# Altium schematic sheet Main Board.SchDoc (part 2 of 2)
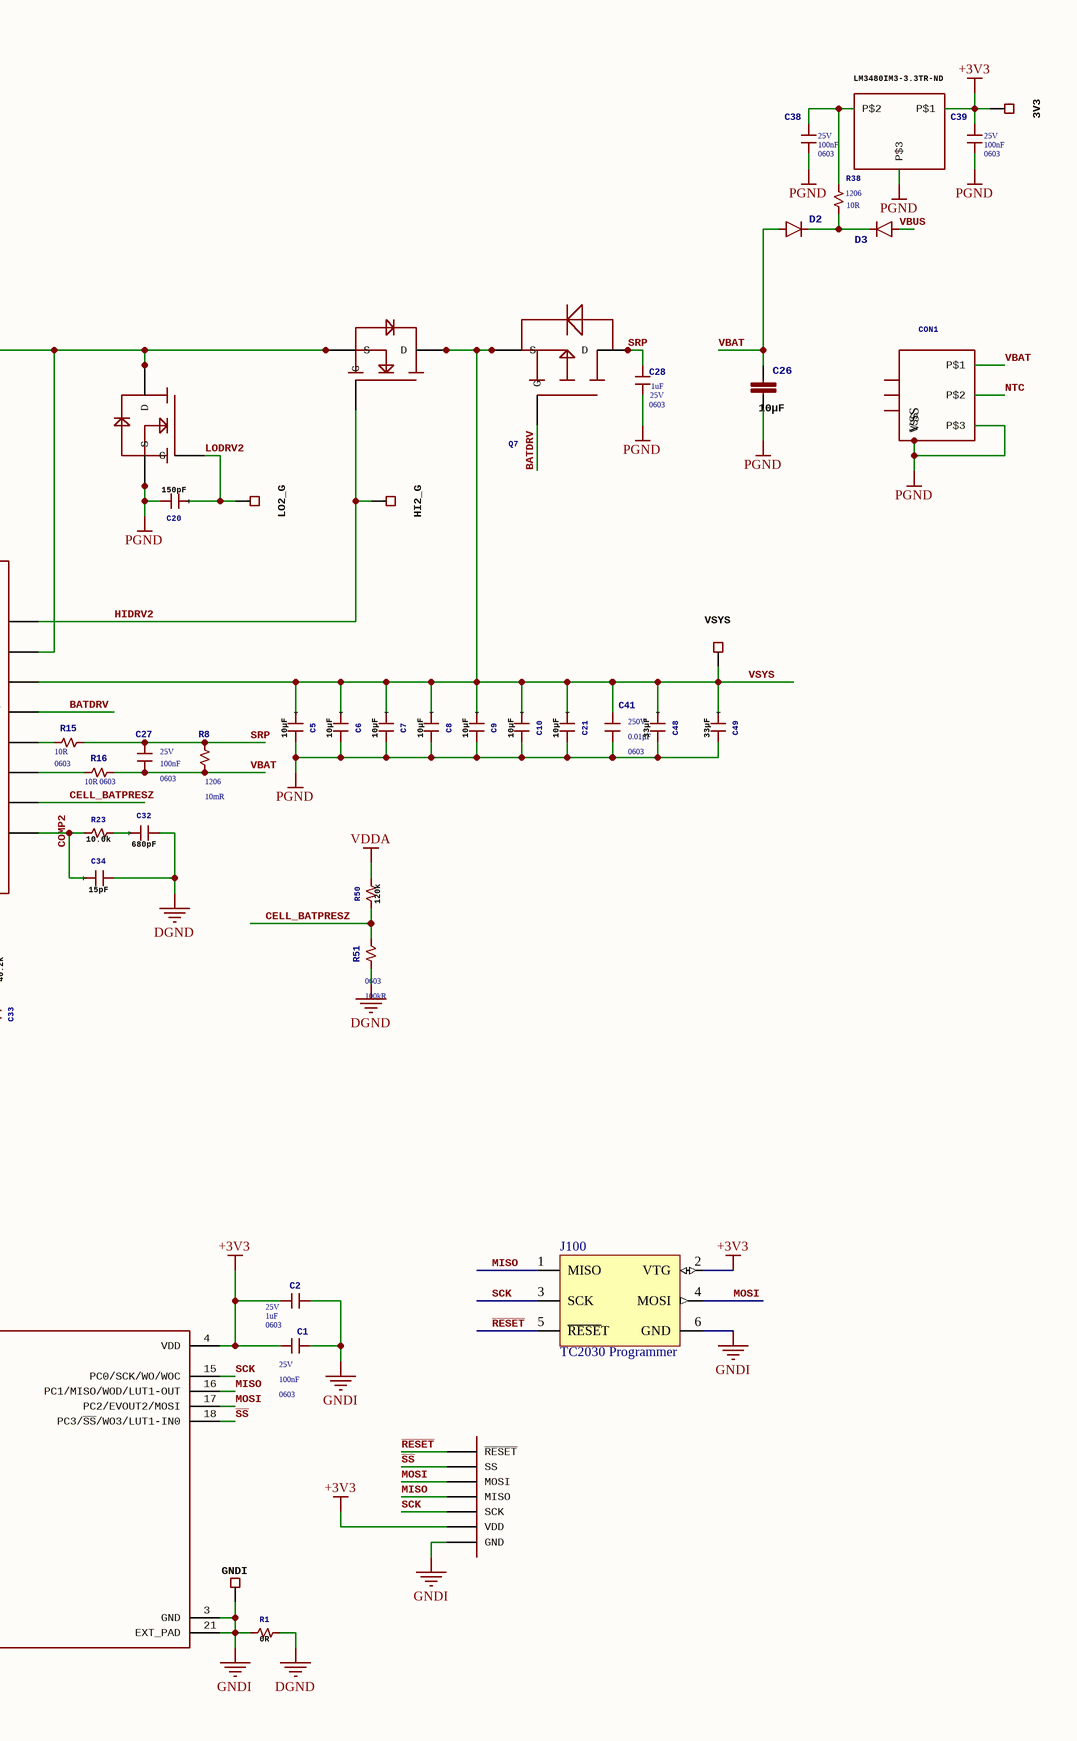
[diagram p2: Main Board.SchDoc, right]

## Library data of the parts
C1 C22 C27 C38 C39 = CGA3E2X7R1E104K080AA: 0.1µF ±10% 25V Ceramic Capacitor X7R 0603 (1608 Metric); Manufacturer: TDK; Supplier 1: Digi-Key; Manufacturer Part Number: CGA3E2X7R1E104K080AA; Stock 1: 2114238; Pricing 1: 1 = 0.10000, 10 = 0.05700, 100 = 0.02530, 500 = 0.01810, 1000 = 0.01422 (USD); RoHS: Yes; Mount: Surface Mount; Weight: 7.1E-05oz; Case Code (Metric): 1608; Case Code (Imperial): 0603; Min Operating Temperature: -55°C; Max Operating Temperature: 125°C; Packaging: Tape and Reel; Tolerance: 10%; Dielectric: X7R; Termination: SMD/SMT; Package Quantity: 1; Voltage Rating (DC): 25V; Composition: Ceramic; Length: 1.6mm; Height: 0.8mm; Depth: 0.8mm; Width: 0.031inch; Thickness: 0.035inch; Ratings: AEC-Q200; Lead Free: Lead Free; REACH SVHC: No SVHC; ComponentLink1URL: https://datasheet.ciiva.com/24220/cga3e2x7r1e104k080aa-265934-24220022.pdf?src-supplier=Mouser; ComponentLink1Description: https://datasheet.ciiva.com/24220/cga3e2x7r1e104k080aa-265934-24220022.pdf?src-supplier=Mouser; ComponentLink2URL: https://datasheet.ciiva.com/22725/1735392-22725638.pdf?src-supplier=Element14; ComponentLink2Description: https://datasheet.ciiva.com/22725/1735392-22725638.pdf?src-supplier=Element14; ComponentLink3URL: https://datasheet.ciiva.com/22725/1735392-22725639.pdf?src-supplier=Element14; ComponentLink3Description: https://datasheet.ciiva.com/22725/1735392-22725639.pdf?src-supplier=Element14; ComponentLink4URL: https://datasheet.ciiva.com/16427/mlccspec-automotive-general-midvoltage-en-16427320.pdf?src-supplier=Future+Electronics; ComponentLink4Description: https://datasheet.ciiva.com/16427/mlccspec-automotive-general-midvoltage-en-16427320.pdf?src-supplier=Future+Electronics; ComponentLink5URL: https://datasheet.ciiva.com/23803/1735392-23803082.pdf?src-supplier=Newark; ComponentLink5Description: https://datasheet.ciiva.com/23803/1735392-23803082.pdf?src-supplier=Newark; Supplier Part Number 1: 445-5667-1-ND; Case/Package: 0603
C2 C18 C28 C29 = CL10B105KA8NNNC: 1µF ±10% 25V Ceramic Capacitor X7R 0603 (1608 Metric); Manufacturer: Samsung; Supplier 1: Digi-Key; Manufacturer Part Number: CL10B105KA8NNNC; Stock 1: 3906966; Pricing 1: 1 = 0.10000, 10 = 0.06000, 100 = 0.02670, 500 = 0.01904, 1000 = 0.01496 (USD); RoHS: Yes; Mount: Surface Mount; Case Code (Metric): 1608; Case Code (Imperial): 0603; Contact Plating: Tin; Min Operating Temperature: -55°C; Max Operating Temperature: 125°C; Tolerance: 10%; Dielectric: X7R; Packaging: Tape and Reel; Voltage Rating: 25V; Package Quantity: 1; Length: 1.6mm; Height: 0.8mm; Width: 0.031inch; Thickness: 0.035inch; Depth: 0.8mm; Radiation Hardening: No; ComponentLink1URL: https://datasheet.ciiva.com/16449/cl10b105ka8nnnc-16449544.pdf?src-supplier=Future+Electronics; ComponentLink1Description: https://datasheet.ciiva.com/16449/cl10b105ka8nnnc-16449544.pdf?src-supplier=Future+Electronics; ComponentLink2URL: https://datasheet.ciiva.com/15195/getdatasheetpartid-359554-15195726.pdf?src-supplier=Verical; ComponentLink2Description: https://datasheet.ciiva.com/15195/getdatasheetpartid-359554-15195726.pdf?src-supplier=Verical; Supplier Part Number 1: 1276-1184-1-ND; Case/Package: 0603
C3 C4 C23 C24 C44 C45 = GRM21BR61E106KA73L: 10µF ±10% 25V Ceramic Capacitor X5R 0805 (2012 Metric); Manufacturer: Murata; Supplier 1: Digi-Key; Manufacturer Part Number: GRM21BR61E106KA73L; Stock 1: 16089237; Pricing 1: 1 = 0.43000, 10 = 0.29600, 100 = 0.17730, 500 = 0.13300, 1000 = 0.11231 (USD); RoHS: Yes; Mount: Surface Mount; Case Code (Metric): 2012; Case Code (Imperial): 0805; Material: Ceramic; Min Operating Temperature: -55°C; Max Operating Temperature: 85°C; Tolerance: 10%; Dielectric: X5R; Package Quantity: 1; Packaging: Tape and Reel; Voltage Rating (DC): 25V; Termination: SMD/SMT; Voltage: 25V; Length: 2mm; Height: 1.25mm; Width: 0.049inch; Thickness: 0.053inch; Depth: 1.25mm; Radiation Hardening: No; REACH SVHC: Unknown; Lead Free: Lead Free; ComponentLink1URL: https://datasheet.ciiva.com/5424/product-5424327.pdf?src-supplier=Mouser; ComponentLink1Description: https://datasheet.ciiva.com/5424/product-5424327.pdf?src-supplier=Mouser; ComponentLink2URL: https://datasheet.ciiva.com/22774/1747469-22774396.pdf?src-supplier=Farnell; ComponentLink2Description: https://datasheet.ciiva.com/22774/1747469-22774396.pdf?src-supplier=Farnell; ComponentLink3URL: https://datasheet.ciiva.com/28584/626718-28584288.pdf?src-supplier=Element14; ComponentLink3Description: https://datasheet.ciiva.com/28584/626718-28584288.pdf?src-supplier=Element14; ComponentLink4URL: https://datasheet.ciiva.com/16440/grm21br61e106ka73l-16440627.pdf?src-supplier=Future+Electronics; ComponentLink4Description: https://datasheet.ciiva.com/16440/grm21br61e106ka73l-16440627.pdf?src-supplier=Future+Electronics; ComponentLink5URL: https://datasheet.ciiva.com/29199/454623-da-01-en-vs-kondensator-0805-29199615.pdf?src-supplier=Conrad; ComponentLink5Description: https://datasheet.ciiva.com/29199/454623-da-01-en-vs-kondensator-0805-29199615.pdf?src-supplier=Conrad; ComponentLink6URL: https://datasheet.ciiva.com/139/partnumbering-e-01-139184.pdf?src-supplier=Digi-Key; ComponentLink6Description: https://datasheet.ciiva.com/139/partnumbering-e-01-139184.pdf?src-supplier=Digi-Key; ComponentLink7URL: https://datasheet.ciiva.com/28584/626718-28584279.pdf?src-supplier=Element14; ComponentLink7Description: https://datasheet.ciiva.com/28584/626718-28584279.pdf?src-supplier=Element14; ComponentLink8URL: https://datasheet.ciiva.com/14116/grmseries-highdielectrictype-eng-14116376.pdf?src-supplier=Distrelec; ComponentLink8Description: https://datasheet.ciiva.com/14116/grmseries-highdielectrictype-eng-14116376.pdf?src-supplier=Distrelec; ComponentLink9URL: https://datasheet.ciiva.com/139/partnumbering-e-01-139182.pdf?src-supplier=Digi-Key; ComponentLink9Description: https://datasheet.ciiva.com/139/partnumbering-e-01-139182.pdf?src-supplier=Digi-Key; ComponentLink10URL: https://datasheet.ciiva.com/139/partnumbering-e-01-139183.pdf?src-supplier=Digi-Key; ComponentLink10Description: https://datasheet.ciiva.com/139/partnumbering-e-01-139183.pdf?src-supplier=Digi-Key; ComponentLink11URL: https://datasheet.ciiva.com/7719/1747469-7719093.pdf?src-supplier=Element14; ComponentLink11Description: https://datasheet.ciiva.com/7719/1747469-7719093.pdf?src-supplier=Element14; Supplier Part Number 1: 490-5523-1-ND; Case/Package: 0805
C5-C10 C21 C25 = SMD_CAP0805: GateName_1: G$1; SymbolName_1: CAPACITOR; DeviceName: 0805; LibraryName: Roambotics; DeviceSetName: SMD_CAP; +: +
C11 C31-C34 = SMD_CAP0402: GateName_1: G$1; SymbolName_1: CAPACITOR; DeviceName: 0402; LibraryName: Roambotics; DeviceSetName: SMD_CAP; +: +
C12 C41 = C0603C103KARACAUTO: 0.01µF ±10% 250V Ceramic Capacitor X7R 0603 (1608 Metric); Manufacturer: KEMET; Supplier 1: Digi-Key; Manufacturer Part Number: C0603C103KARACAUTO; Stock 1: 11816; Pricing 1: 1 = 1.04000, 10 = 0.78800, 100 = 0.56390, 500 = 0.43658, 1000 = 0.37595 (USD); RoHS: No; ComponentLink1URL: https://api.kemet.com/component-edge/download/datasheet/C0603C103KARACAUTO.pdf?src-supplier=Digi-Key; ComponentLink1Description: https://api.kemet.com/component-edge/download/datasheet/C0603C103KARACAUTO.pdf?src-supplier=Digi-Key; Supplier Part Number 1: 399-17960-1-ND; Package: 0603
C15 C16 C19 C20 C30 = SMD_CAP0603: GateName_1: G$1; SymbolName_1: CAPACITOR; DeviceName: 0603; LibraryName: Roambotics; DeviceSetName: SMD_CAP; +: +
C17 = GRM1555C1H102JA01D: 1000pF ±5% 50V Ceramic Capacitor C0G, NP0 0402 (1005 Metric); Manufacturer: Murata; Insulation Resistance: 10GR; Temperature Coefficient: 30ppm/°C; Supplier 1: Digi-Key; Manufacturer Part Number: GRM1555C1H102JA01D; Stock 1: 6629230; Pricing 1: 1 = 0.11000, 10 = 0.07900, 100 = 0.03700, 500 = 0.02596, 1000 = 0.02149, 2500 = 0.02000, 5000 = 0.01830 (USD); RoHS: Yes; Mount: Surface Mount; Number of Pins: 2; Case Code (Metric): 1005; Case Code (Imperial): 0402; Material: Ceramic; Dielectric Material: Ceramic; Min Operating Temperature: -55°C; Max Operating Temperature: 125°C; Tolerance: 5%; Dielectric: C0G; Package Quantity: 1; Packaging: Tape and Reel; Voltage Rating (DC): 50V; Termination: SMD/SMT; Voltage: 50V; Length: 1mm; Height: 0.5mm; Width: 0.5mm; Thickness: 0.022inch; Depth: 0.5mm; Radiation Hardening: No; REACH SVHC: No SVHC; Lead Free: Lead Free; ComponentLink1URL: https://datasheet.ciiva.com/132/product-132800.pdf?src-supplier=Digi-Key; ComponentLink1Description: https://datasheet.ciiva.com/132/product-132800.pdf?src-supplier=Digi-Key; ComponentLink2URL: https://datasheet.ciiva.com/34302/1855908-34302849.pdf?src-supplier=Jameco; ComponentLink2Description: https://datasheet.ciiva.com/34302/1855908-34302849.pdf?src-supplier=Jameco; ComponentLink3URL: https://datasheet.ciiva.com/18184/getdatasheetpartid-90260-18184180.pdf?src-supplier=Verical; ComponentLink3Description: https://datasheet.ciiva.com/18184/getdatasheetpartid-90260-18184180.pdf?src-supplier=Verical; ComponentLink4URL: https://datasheet.ciiva.com/11786/0900766b807a1cab-11786727.pdf?src-supplier=RSComponents; ComponentLink4Description: https://datasheet.ciiva.com/11786/0900766b807a1cab-11786727.pdf?src-supplier=RSComponents; ComponentLink5URL: https://datasheet.ciiva.com/132/grm1555c1h102ja01-01-132799.pdf?src-supplier=Digi-Key; ComponentLink5Description: https://datasheet.ciiva.com/132/grm1555c1h102ja01-01-132799.pdf?src-supplier=Digi-Key; ComponentLink6URL: https://datasheet.ciiva.com/29200/453569-da-01-en-vs-kondensator-0402-29200121.pdf?src-supplier=Conrad; ComponentLink6Description: https://datasheet.ciiva.com/29200/453569-da-01-en-vs-kondensator-0402-29200121.pdf?src-supplier=Conrad; ComponentLink7URL: https://datasheet.ciiva.com/132/grm1555c1h102ja01-01-132801.pdf?src-supplier=Digi-Key; ComponentLink7Description: https://datasheet.ciiva.com/132/grm1555c1h102ja01-01-132801.pdf?src-supplier=Digi-Key; ComponentLink8URL: https://datasheet.ciiva.com/7828/4360-7828821.pdf?src-supplier=Element14; ComponentLink8Description: https://datasheet.ciiva.com/7828/4360-7828821.pdf?src-supplier=Element14; ComponentLink9URL: https://datasheet.ciiva.com/7828/1747436-7828822.pdf?src-supplier=Element14; ComponentLink9Description: https://datasheet.ciiva.com/7828/1747436-7828822.pdf?src-supplier=Element14; ComponentLink10URL: https://datasheet.ciiva.com/14116/grmseries-tc-hitype-eng-14116919.pdf?src-supplier=Distrelec; ComponentLink10Description: https://datasheet.ciiva.com/14116/grmseries-tc-hitype-eng-14116919.pdf?src-supplier=Distrelec; ComponentLink11URL: https://datasheet.ciiva.com/14116/grmseries-tc-hitype-eng-14116858.pdf?src-supplier=Distrelec; ComponentLink11Description: https://datasheet.ciiva.com/14116/grmseries-tc-hitype-eng-14116858.pdf?src-supplier=Distrelec; Supplier Part Number 1: 490-3244-1-ND; Case/Package: 0402
C26 = C-EUC1206: CAPACITOR, European symbol; GateName_1: G$1; SymbolName_1: C-EU; DeviceName: C1206; LibraryName: rcl; DeviceSetName: C-EU; SPICEPREFIX: C
C35-C37 = C0603C101J5GACTU: 100pF ±5% 50V Ceramic Capacitor C0G, NP0 0603 (1608 Metric); Manufacturer: KEMET; Dissipation Factor: 0.1%; ComponentLink1URL: https://datasheet.ciiva.com/14906/partnumbering-e-01-14906490.pdf?src-supplier=Digi-Key; ComponentLink1Description: https://datasheet.ciiva.com/14906/partnumbering-e-01-14906490.pdf?src-supplier=Digi-Key; ComponentLink2URL: https://datasheet.ciiva.com/14906/partnumbering-e-01-14906491.pdf?src-supplier=Digi-Key; ComponentLink2Description: https://datasheet.ciiva.com/14906/partnumbering-e-01-14906491.pdf?src-supplier=Digi-Key; ComponentLink3URL: https://datasheet.ciiva.com/14906/partnumbering-e-01-14906492.pdf?src-supplier=Digi-Key; ComponentLink3Description: https://datasheet.ciiva.com/14906/partnumbering-e-01-14906492.pdf?src-supplier=Digi-Key; Supplier 1: Digi-Key; Manufacturer Part Number: C0603C101J5GACTU; Stock 1: 4733988; Pricing 1: 1 = 0.15000, 10 = 0.11000, 100 = 0.05150, 500 = 0.03614, 1000 = 0.02992 (USD); RoHS: Yes; Mount: Surface Mount; Case Code (Imperial): 0603; Case Code (Metric): 1608; Min Operating Temperature: -55°C; Max Operating Temperature: 125°C; Tolerance: 5%; Packaging: Tape and Reel; Package Quantity: 4000; Voltage Rating: 50V; Voltage Rating (DC): 50V; Dielectric: NP0; Termination: SMD/SMT; Length: 1.6mm; Height: 0.8mm; Width: 0.8mm; Lead Pitch: 0.7mm; Depth: 0.8mm; Radiation Hardening: No; ComponentLink4URL: https://datasheet.ciiva.com/28645/1789732-28645525.pdf?src-supplier=Element14; ComponentLink4Description: https://datasheet.ciiva.com/28645/1789732-28645525.pdf?src-supplier=Element14; ComponentLink5URL: https://datasheet.ciiva.com/6126/f9080b-0402-series-c0g-6126680.pdf?src-supplier=Farnell; ComponentLink5Description: https://datasheet.ciiva.com/6126/f9080b-0402-series-c0g-6126680.pdf?src-supplier=Farnell; ComponentLink6URL: https://datasheet.ciiva.com/26847/getdatasheetpartid-315853-26847483.pdf?src-supplier=Verical; ComponentLink6Description: https://datasheet.ciiva.com/26847/getdatasheetpartid-315853-26847483.pdf?src-supplier=Verical; ComponentLink7URL: https://datasheet.ciiva.com/13394/kem-c1003-c0g-smd-356956-13394447.pdf?src-supplier=Mouser; ComponentLink7Description: https://datasheet.ciiva.com/13394/kem-c1003-c0g-smd-356956-13394447.pdf?src-supplier=Mouser; Supplier Part Number 1: 399-1061-1-ND; Case/Package: 0603
C46 C47 = CL10B333KA8NNNC: 0.033µF ±10% 25V Ceramic Capacitor X7R 0603 (1608 Metric); Manufacturer: Samsung; Supplier 1: Digi-Key; Manufacturer Part Number: CL10B333KA8NNNC; Stock 1: 386545; Pricing 1: 1 = 0.10000, 10 = 0.06100, 100 = 0.02720, 500 = 0.01944, 1000 = 0.01528 (USD); RoHS: Yes; Mount: Surface Mount; Case Code (Metric): 1608; Case Code (Imperial): 0603; Min Operating Temperature: -55°C; Max Operating Temperature: 125°C; Tolerance: 10%; Dielectric: X7R; Package Quantity: 1; Packaging: Tape and Reel; Voltage Rating (DC): 25V; Length: 1.6mm; Height: 0.8mm; Width: 0.031inch; Thickness: 0.035inch; Depth: 0.8mm; Radiation Hardening: No; Lead Free: Lead Free; ComponentLink1URL: https://datasheet.ciiva.com/26838/getdatasheetpartid-745367-26838459.pdf?src-supplier=Verical; ComponentLink1Description: https://datasheet.ciiva.com/26838/getdatasheetpartid-745367-26838459.pdf?src-supplier=Verical; ComponentLink2URL: https://datasheet.ciiva.com/25781/cl10b333ka8nnnc-25781520.pdf?src-supplier=Digi-Key; ComponentLink2Description: https://datasheet.ciiva.com/25781/cl10b333ka8nnnc-25781520.pdf?src-supplier=Digi-Key; ComponentLink3URL: https://datasheet.ciiva.com/16218/cl05b104kq5nnnc-16218987.pdf?src-supplier=Future+Electronics; ComponentLink3Description: https://datasheet.ciiva.com/16218/cl05b104kq5nnnc-16218987.pdf?src-supplier=Future+Electronics; Supplier Part Number 1: 1276-2038-1-ND; Case/Package: 0603
C48 C49 = SMD_CAP1206: GateName_1: G$1; SymbolName_1: CAPACITOR; DeviceName: 1206; LibraryName: Roambotics; DeviceSetName: SMD_CAP; +: +
C53 = C3216X5R1E336M160AC: 33µF ±20% 25V Ceramic Capacitor X5R 1206 (3216 Metric); Manufacturer: TDK; Supplier 1: Digi-Key; Manufacturer Part Number: C3216X5R1E336M160AC; Description: CAP CER 33UF 25V X5R 1206; Stock 1: 0; Pricing 1: 1 = 1.31000, 10 = 1.03500, 100 = 0.77630, 500 = 0.58650, 1000 = 0.51750 (USD); RoHS: Yes; Mount: Surface Mount; Weight: 0.000571oz; Case Code (Metric): 3216; Case Code (Imperial): 1206; Dielectric Material: Ceramic; Min Operating Temperature: -55°C; Max Operating Temperature: 85°C; Package Quantity: 1; Tolerance: 20%; Packaging: Tape and Reel; Voltage Rating (DC): 25V; Dielectric: X5R; Termination: SMD/SMT; Composition: Ceramic; Length: 3.2mm; Width: 0.063inch; Depth: 1.6mm; Thickness: 1.6mm; REACH SVHC: No SVHC; Lead Free: Lead Free; ComponentLink1URL: https://datasheet.ciiva.com/24216/c3216x5r1e336m160ac-265051-24216512.pdf?src-supplier=Mouser; ComponentLink1Description: https://datasheet.ciiva.com/24216/c3216x5r1e336m160ac-265051-24216512.pdf?src-supplier=Mouser; ComponentLink2URL: https://datasheet.ciiva.com/6285/tdkmlcccaprange-6285278.pdf?src-supplier=Digi-Key; ComponentLink2Description: https://datasheet.ciiva.com/6285/tdkmlcccaprange-6285278.pdf?src-supplier=Digi-Key; Supplier Part Number 1: 445-8046-1-ND; Case/Package: 1206
CON1 = BM03B-ADHKS-GAN-ETB: GateName_1: G$1; SymbolName_1: BM03B-ADHKS-GAN-ETB; LibraryName: Roambotics; DeviceSetName: BM03B-ADHKS-GAN-ETB
CON2 = CONN SSL RCPT 4POS 2MM SOLDER: SSL Connector 4 Position Receptacle Board to Board - Card Edge 0.079" (2.00mm) Solder; Manufacturer: Kyocera AVX; Voltage Rating: 300V; Current Rating: 2A; Mating Cycles: 10; Number of Positions: 4; Pitch: 0.079inch; Row Spacing: 6.5mm; Supplier 1: Digi-Key; Stock 1: 2516; Pricing 1: 1 = 1.01000, 10 = 0.89200, 25 = 0.83960, 50 = 0.80460, 100 = 0.76960, 250 = 0.69960 (USD); RoHS: Yes; Mount: Surface Mount; Contact Material: Copper Alloy; Contact Plating: Gold; Housing Color: White; Housing Material: Nylon; Min Operating Temperature: -40°C; Max Operating Temperature: 120°C; Number of Rows: 1; Packaging: Tape and Reel; Package Quantity: 900; Connector Type: Receptacle; Termination: SMD/SMT; Gender: Receptacle; Number of Contacts: 4; REACH SVHC: No SVHC; ComponentLink1URL: https://datasheet.ciiva.com/29706/topentrycardedge-29706485.pdf?src-supplier=Digi-Key; ComponentLink1Description: https://datasheet.ciiva.com/29706/topentrycardedge-29706485.pdf?src-supplier=Digi-Key; Supplier Part Number 1: 478-8738-1-ND; Manufacturer Part Number: 009159004551906
CON3 = AVX-9159-4-PIN-CARD-EDGE: GateName_1: G$1; SymbolName_1: 4_PIN_CONNECTOR; LibraryName: Roambotics; DeviceSetName: AVX-9159-4-PIN-CARD-EDGE
D1 = SMAJ26CA: 42.1V Clamp 9.5A Ipp Tvs Diode Surface Mount DO-214AC (SMA); Manufacturer: Littelfuse; Direction: Bidirectional; Min Breakdown Voltage: 28.9V; Peak Pulse Power: 400W; Number of Channels: 1; Test Current: 1mA; Power Line Protection: No; Max Breakdown Voltage: 31.9V; Max Power Dissipation: 3.3W; Leakage Current: 1uA; Supplier 1: Digi-Key; Stock 1: 19712; Pricing 1: 1 = 0.57000, 10 = 0.44600, 25 = 0.37600, 100 = 0.30590, 250 = 0.25348, 500 = 0.20980, 1000 = 0.15734, 2500 = 0.14423 (USD); RoHS: Yes; Mount: Surface Mount; Number of Pins: 2; Min Operating Temperature: -55°C; Max Operating Temperature: 150°C; Package Quantity: 5000; Packaging: Tape and Reel; Operating Supply Voltage: 26V; Max Surge Current: 9.5A; Reverse Standoff Voltage: 26V; Clamping Voltage: 42.1V; Breakdown Voltage: 28.9V; Polarity: Bidirectional; Peak Pulse Current: 9.5A; Voltage Rating (DC): 26V; Reverse Breakdown Voltage: 28.9V; Number of Bidirectional Channels: 1; Termination: SMD/SMT; Power Dissipation: 400W; Number of Elements: 1; Composition: Zener; Length: 5.28mm; Height: 2.29mm; Width: 2.79mm; Lead Free: Lead Free; REACH SVHC: No SVHC; ComponentLink1URL: https://datasheet.ciiva.com/331/littelfuse-tvs-diode-smaj-datasheet-pdf-331088.pdf?src-supplier=Digi-Key; ComponentLink1Description: https://datasheet.ciiva.com/331/littelfuse-tvs-diode-smaj-datasheet-pdf-331088.pdf?src-supplier=Digi-Key; ComponentLink2URL: https://datasheet.ciiva.com/331/littelfuse-tvs-diode-smaj-datasheet-pdf-331089.pdf?src-supplier=Digi-Key; ComponentLink2Description: https://datasheet.ciiva.com/331/littelfuse-tvs-diode-smaj-datasheet-pdf-331089.pdf?src-supplier=Digi-Key; ComponentLink3URL: https://datasheet.ciiva.com/4509/littelfuse-tvs-diode-smaj-23503-4509438.pdf?src-supplier=Mouser; ComponentLink3Description: https://datasheet.ciiva.com/4509/littelfuse-tvs-diode-smaj-23503-4509438.pdf?src-supplier=Mouser; ComponentLink4URL: https://datasheet.ciiva.com/331/littelfuse-tvs-diode-smaj-datasheet-pdf-331087.pdf?src-supplier=Digi-Key; ComponentLink4Description: https://datasheet.ciiva.com/331/littelfuse-tvs-diode-smaj-datasheet-pdf-331087.pdf?src-supplier=Digi-Key; Supplier Part Number 1: SMAJ26CALFCT-ND; Manufacturer Part Number: SMAJ26CA
D2 D3 = DIODE-SOD323-R: DIODE; GateName_1: G$1; SymbolName_1: D; DeviceSetName: DIODE-; DeviceName: SOD323-R; LibraryName: diode
IC1 = BQ25713B: GateName_1: G$1; SymbolName_1: BQ25713B; LibraryName: Roambotics; DeviceSetName: BQ25713B
J100 = TC2030 Programmer: Manufacturer Part Number: TC2030 6-pin programmer; Manufacturer: Tag-Connect
L1 = SRP7030-2R2MIND_BOURNS_SRP7030-M: MANUFACTURER_PART_NUMBER: SRP70302R2M; GateName_1: A; SymbolName_1: INDUCTOR_MK2; VENDOR: Bourns Electronics; DeviceName: IND_BOURNS_SRP7030-M; LibraryName: Roambotics; DeviceSetName: SRP7030-2R2M
LED1 = CL-426F-AA-SD-TS: TRICOLOR SIDE FIRING 2.8 X 0.85; Manufacturer: Citizen; Color: Red, Green, Blue (RGB); Millicandela Rating: 160mcd Red, 250mcd Green, 52mcd Blue; Lens Style/Size: Rectangle with Flat Top, 2.80mm x 0.35mm; Voltage - Forward (Vf) (Typ): 1.85V Red, 2.7V Green, 2.75V Blue; Current - Test: 5mA Red, 5mA Green, 5mA Blue; Wavelength - Dominant: 628nm Red, 530nm Green, 470nm Blue; Supplier 1: Digi-Key; Manufacturer Part Number: CL-426F-AA-SD-TS; RoHS: RoHS Compliant; Category: Optoelectronics; Stock 1: 5632; Pricing 1: 1=1.28, 10=1.037, 25=0.7976, 100=0.7178, 250=0.638, 500=0.5423, 1000=0.4466 (USD); Packaging: Cut Tape (CT); Part Status: Active; Lens Color: -; Lens Transparency: -; Viewing Angle: -; Mounting Type: Surface Mount, Right Angle; Wavelength - Peak: -; Features: -; Package / Case: 4-SMD, No Lead; Supplier Device Package: -; Height (Max): 0.35mm; ComponentLink1URL: http://media.digikey.com/pdf/Data%20Sheets/Citizen%20PDFs/CL-426_Web.pdf; ComponentLink1Description: http://media.digikey.com/pdf/Data%20Sheets/Citizen%20PDFs/CL-426_Web.pdf; Supplier Part Number 1: 1642-1512-1-ND
PAD1-PAD7 PAD10-PAD15 = 1X1_PAD: GateName_1: G$1; SymbolName_1: TEST_PAD; LibraryName: Roambotics; DeviceSetName: 1X1_PAD
Q1-Q4 = CSD17551Q3A: GateName_1: G$1; SymbolName_1: N-CHANNEL_MOSFET; LibraryName: Roambotics; DeviceSetName: CSD17551Q3A
Q5 Q6 Q8 Q10 = MOSFET N-CH 60V 300MA SOT-23: N-Channel 60V 300mA (Ta) 830mW (Ta) Surface Mount TO-236AB; Manufacturer: NXP Semiconductors; Gate to Source Voltage (Vgs): 30V; Input Capacitance: 50pF; Number of Elements: 1; Drain to Source Resistance: 5R; Nominal Vgs: 2V; Element Configuration: Single; Supplier 1: Digi-Key; Stock 1: 534847; Pricing 1: 1 = 0.25000, 10 = 0.22700, 100 = 0.12690, 500 = 0.06798, 1000 = 0.04623 (USD); RoHS: Yes; Case/Package: SOT; Number of Pins: 3; Weight: 0.01lb; Contact Plating: Tin; Min Operating Temperature: -65°C; Max Operating Temperature: 150°C; Continuous Drain Current (ID): 300mA; Packaging: Tape and Reel; Drain to Source Voltage (Vdss): 60V; Max Power Dissipation: 830mW; Power Dissipation: 830mW; Package Quantity: 1; Rds On Max: 5R; Max Dual Supply Voltage: 60V; Dual Supply Voltage: 60V; Drain to Source Breakdown Voltage: 60V; On-State Resistance: 5R; Threshold Voltage: 2V; Termination: SMD/SMT; Current: 300mA; Voltage: 60V; Length: 3mm; Height: 1mm; Width: 1.4mm; Radiation Hardening: No; REACH SVHC: No SVHC; Lead Free: Lead Free; ComponentLink1URL: https://datasheet.ciiva.com/934/2n7002-934480.pdf?src-supplier=Digi-Key; ComponentLink1Description: https://datasheet.ciiva.com/934/2n7002-934480.pdf?src-supplier=Digi-Key; ComponentLink2URL: https://datasheet.ciiva.com/4440/2n7002-99839-4440587.pdf?src-supplier=Mouser; ComponentLink2Description: https://datasheet.ciiva.com/4440/2n7002-99839-4440587.pdf?src-supplier=Mouser; ComponentLink3URL: https://datasheet.ciiva.com/22643/1499179-22643491.pdf?src-supplier=Farnell; ComponentLink3Description: https://datasheet.ciiva.com/22643/1499179-22643491.pdf?src-supplier=Farnell; ComponentLink4URL: https://datasheet.ciiva.com/22655/1499179-22655463.pdf?src-supplier=Element14; ComponentLink4Description: https://datasheet.ciiva.com/22655/1499179-22655463.pdf?src-supplier=Element14; ComponentLink5URL: https://datasheet.ciiva.com/25900/2n7002-25900173.pdf?src-supplier=Avnet+Europe; ComponentLink5Description: https://datasheet.ciiva.com/25900/2n7002-25900173.pdf?src-supplier=Avnet+Europe; ComponentLink6URL: https://datasheet.ciiva.com/934/2n7002-934481.pdf?src-supplier=Digi-Key; ComponentLink6Description: https://datasheet.ciiva.com/934/2n7002-934481.pdf?src-supplier=Digi-Key; ComponentLink7URL: https://datasheet.ciiva.com/33724/1499179-33724310.pdf?src-supplier=Farnell; ComponentLink7Description: https://datasheet.ciiva.com/33724/1499179-33724310.pdf?src-supplier=Farnell; ComponentLink8URL: https://datasheet.ciiva.com/33725/1499179-33725067.pdf?src-supplier=Farnell; ComponentLink8Description: https://datasheet.ciiva.com/33725/1499179-33725067.pdf?src-supplier=Farnell; ComponentLink9URL: https://datasheet.ciiva.com/36856/1499179-36856171.pdf?src-supplier=Element14; ComponentLink9Description: https://datasheet.ciiva.com/36856/1499179-36856171.pdf?src-supplier=Element14; ComponentLink10URL: https://datasheet.ciiva.com/934/2n7002-934479.pdf?src-supplier=Digi-Key; ComponentLink10Description: https://datasheet.ciiva.com/934/2n7002-934479.pdf?src-supplier=Digi-Key; Supplier Part Number 1: 1727-2764-1-ND; Manufacturer Part Number: 2N7002,215
Q5-6 = IRF9358TRPBF: Mosfet Array 2 P-Channel (Dual) 30V 9.2A 2W Surface Mount 8-SO; Manufacturer: International Rectifier; Rise Time: 7.2ns; Gate to Source Voltage (Vgs): 20V; Turn-On Delay Time: 5.7ns; Turn-Off Delay Time: 146ns; Fall Time: 69ns; Rds On Max: 16.3mR; Input Capacitance: 1.74nF; Nominal Vgs: -1.8V; Drain to Source Resistance: 23.8mR; Drain to Source Breakdown Voltage: -30V; Supplier 1: Digi-Key; Stock 1: 34724; Pricing 1: 1 = 1.22000, 10 = 1.08300, 100 = 0.85580, 500 = 0.66368, 1000 = 0.52396 (USD); RoHS: Yes; Mount: Surface Mount; Case/Package: SOIC; Number of Pins: 8; Min Operating Temperature: -55°C; Max Operating Temperature: 150°C; Continuous Drain Current (ID): 9.2A; Package Quantity: 1; Packaging: Tape and Reel; Power Dissipation: 2W; Drain to Source Voltage (Vdss): 30V; Max Power Dissipation: 2W; Element Configuration: Dual; Length: 5mm; Height: 1.5mm; Width: 4mm; Radiation Hardening: No; REACH SVHC: No SVHC; ComponentLink1URL: https://datasheet.ciiva.com/4438/irf9358pbf-72620-4438704.pdf?src-supplier=Mouser; ComponentLink1Description: https://datasheet.ciiva.com/4438/irf9358pbf-72620-4438704.pdf?src-supplier=Mouser; ComponentLink2URL: https://datasheet.ciiva.com/17317/irf9358pbf-17317301.pdf?src-supplier=Avnet+Europe; ComponentLink2Description: https://datasheet.ciiva.com/17317/irf9358pbf-17317301.pdf?src-supplier=Avnet+Europe; ComponentLink3URL: https://datasheet.ciiva.com/929/irf9358pbf-929243.pdf?src-supplier=Digi-Key; ComponentLink3Description: https://datasheet.ciiva.com/929/irf9358pbf-929243.pdf?src-supplier=Digi-Key; ComponentLink4URL: https://datasheet.ciiva.com/11169/irf9358pbf-11169947.pdf?src-supplier=Avnet; ComponentLink4Description: https://datasheet.ciiva.com/11169/irf9358pbf-11169947.pdf?src-supplier=Avnet; ComponentLink5URL: https://datasheet.ciiva.com/929/irf9358pbf-929244.pdf?src-supplier=Digi-Key; ComponentLink5Description: https://datasheet.ciiva.com/929/irf9358pbf-929244.pdf?src-supplier=Digi-Key; ComponentLink6URL: https://datasheet.ciiva.com/929/irf9358pbf-929245.pdf?src-supplier=Digi-Key; ComponentLink6Description: https://datasheet.ciiva.com/929/irf9358pbf-929245.pdf?src-supplier=Digi-Key; ComponentLink7URL: https://datasheet.ciiva.com/7798/irf9358pbf-7798959.pdf?src-supplier=Element14; ComponentLink7Description: https://datasheet.ciiva.com/7798/irf9358pbf-7798959.pdf?src-supplier=Element14; Supplier Part Number 1: IRF9358TRPBFCT-ND; Manufacturer Part Number: IRF9358TRPBF
Q7 = CSD25402Q3A: GateName_1: G$1; SymbolName_1: P-CHANNEL_MOSFET; LibraryName: Roambotics; DeviceSetName: CSD25402Q3A
Q9AB = DCX124EK-7-F: TRANS NPN/PNP PREBIAS 0.3W SC74R; Manufacturer: Diodes; Element Configuration: Dual; Collector Emitter Voltage (VCEO): 300mV; hFE Min: 80; Max Collector Current: 100mA; Transition Frequency: 250MHz; Max Power Dissipation: 300mW; Collector Emitter Breakdown Voltage: 50V; Polarity: NPN; Continuous Collector Current: 500nA; Number of Channels: 2; Supplier 1: Digi-Key; Stock 1: 3393; Pricing 1: 1 = 0.42000, 10 = 0.31100, 100 = 0.17640, 500 = 0.11680, 1000 = 0.08955 (USD); RoHS: Yes; Mount: Surface Mount; Case/Package: SOT-26; Number of Pins: 6; Min Operating Temperature: -55°C; Max Operating Temperature: 150°C; Package Quantity: 3000; Packaging: Tape and Reel; Max Breakdown Voltage: 50V; Voltage Rating (DC): 50V; Current Rating: 100mA; Length: 3.1mm; Height: 1.3mm; Width: 1.7mm; REACH SVHC: No SVHC; Lead Free: Lead Free; ComponentLink1URL: https://datasheet.ciiva.com/16615/ds30350-16615594.pdf?src-supplier=Avnet+Europe; ComponentLink1Description: https://datasheet.ciiva.com/16615/ds30350-16615594.pdf?src-supplier=Avnet+Europe; Supplier Part Number 1: DCX124EK-FDICT-ND; Manufacturer Part Number: DCX124EK-7-F
R1 R6 R20-R23 = SMD_RES0402: GateName_1: G$1; SymbolName_1: RESISTOR; DeviceName: 0402; LibraryName: Roambotics; DeviceSetName: SMD_RES
R2 R8 = WSLP1206R0100FEA: 10 mOhms ±1% 1W Chip Resistor 1206 (3216 Metric) Anti-Sulfur, Automotive AEC-Q200, Current Sense, Moisture Resistant, Pulse Withstanding Metal Element; Manufacturer: Vishay Dale; Temperature Coefficient: 75ppm/°C; Supplier 1: Digi-Key; Manufacturer Part Number: WSLP1206R0100FEA; Stock 1: 312015; Pricing 1: 1 = 0.88000, 10 = 0.76200, 25 = 0.67000, 50 = 0.61220, 100 = 0.53130, 250 = 0.46200, 500 = 0.38346, 1000 = 0.31185 (USD); RoHS: Yes; Mount: Surface Mount; Number of Pins: 2; Weight: 0.000571oz; Contact Plating: Tin; Case Code (Metric): 3216; Case Code (Imperial): 1206; Min Operating Temperature: -65°C; Max Operating Temperature: 170°C; Tolerance: 1%; Power Rating: 1W; Composition: Metal Element; Package Quantity: 1; Packaging: Tape and Reel; Number of Terminations: 2; Termination: SMD/SMT; Military Standard: Not; Max Power Dissipation: 1W; Features: Moisture Resistant; Length: 3.2mm; Height: 0.635mm; Width: 0.063inch; Depth: 1.6mm; Radiation Hardening: No; REACH SVHC: Unknown; Lead Free: Lead Free; ComponentLink1URL: https://datasheet.ciiva.com/2482/wslp-2482962.pdf?src-supplier=Digi-Key; ComponentLink1Description: https://datasheet.ciiva.com/2482/wslp-2482962.pdf?src-supplier=Digi-Key; ComponentLink2URL: https://datasheet.ciiva.com/2482/wslp-2482963.pdf?src-supplier=Digi-Key; ComponentLink2Description: https://datasheet.ciiva.com/2482/wslp-2482963.pdf?src-supplier=Digi-Key; ComponentLink3URL: https://datasheet.ciiva.com/2482/wslp-2482964.pdf?src-supplier=Digi-Key; ComponentLink3Description: https://datasheet.ciiva.com/2482/wslp-2482964.pdf?src-supplier=Digi-Key; ComponentLink4URL: https://datasheet.ciiva.com/46412/1813044-46412936.pdf?src-supplier=Element14; ComponentLink4Description: https://datasheet.ciiva.com/46412/1813044-46412936.pdf?src-supplier=Element14; ComponentLink5URL: https://datasheet.ciiva.com/46412/1813044-46412937.pdf?src-supplier=Element14; ComponentLink5Description: https://datasheet.ciiva.com/46412/1813044-46412937.pdf?src-supplier=Element14; Supplier Part Number 1: WSLP-.01CT-ND; Case/Package: 1206
R3 R4 = RMCF1206JT3R90: 3.9 Ohms ±5% 0.25W, 1/4W Chip Resistor 1206 (3216 Metric) Automotive AEC-Q200 Thick Film; Manufacturer: Stackpole Electronics; Max Power Dissipation: 250mW; Temperature Coefficient: 200ppm/°C; Supplier 1: Digi-Key; Manufacturer Part Number: RMCF1206JT3R90; Stock 1: 4572; Pricing 1: 1 = 0.10000, 10 = 0.03300, 100 = 0.01360, 1000 = 0.00612, 2500 = 0.00531 (USD); RoHS: Yes; Mount: Surface Mount; Contact Plating: Tin; Min Operating Temperature: -55°C; Max Operating Temperature: 155°C; Packaging: Tape and Reel; Tolerance: 5%; Composition: Thick Film; Number of Terminations: 2; Features: Automotive AEC-Q200; Length: 0.126inch; Height: 0.028inch; Width: 0.063inch; Radiation Hardening: No; ComponentLink1URL: https://www.seielect.com/catalog/SEI-RMCF_RMCP.pdf?src-supplier=Avnet; ComponentLink1Description: https://www.seielect.com/catalog/SEI-RMCF_RMCP.pdf?src-supplier=Avnet; ComponentLink2URL: https://www.seielect.com/Catalog/SEI-RMCF_RMCP.pdf?src-supplier=Digi-Key; ComponentLink2Description: https://www.seielect.com/Catalog/SEI-RMCF_RMCP.pdf?src-supplier=Digi-Key; Supplier Part Number 1: RMCF1206JT3R90CT-ND; Case/Package: 1206
R5 = RC0603FR-07232RL: RES SMD 232 OHM 1% 1/10W 0603; Manufacturer: Yageo; Temperature Coefficient: ±100ppm/°C; Power (Watts): 0.1W, 1/10W; Supplier 1: Digi-Key; RoHS: RoHS Compliant; Category: Resistors; Stock 1: 19049; Pricing 1: 1=0.1, 10=0.013, 25=0.0092, 50=0.007, 100=0.0052, 250=0.00396, 500=0.00316, 1000=0.00233 (USD); Packaging: Digi-Reel®; Composition: Thick Film; Features: Moisture Resistant; Operating Temperature: -55°C ~ 155°C; Package / Case: 0603; Supplier Device Package: 0603; Size / Dimension: 0.063" L x 0.031" W (1.60mm x 0.80mm); ComponentLink1URL: http://www.yageo.com/documents/recent/PYu-RC_Group_51_RoHS_L_6.pdf; ComponentLink1Description: http://www.yageo.com/documents/recent/PYu-RC_Group_51_RoHS_L_6.pdf; Supplier Part Number 1: 311-232HRDKR-ND; Tolerance: ±1%; Manufacturer Part Number: RC0603FR-07232RL; Part Status: Active; Height - Seated (Max): 0.022" (0.55mm); Failure Rate: -
R7 R25 R30 R32 R34 R35 R39 R40 R50 = SMD_RES0603: GateName_1: G$1; SymbolName_1: RESISTOR; DeviceName: 0603; LibraryName: Roambotics; DeviceSetName: SMD_RES
R9 R26 R51 = RC0603FR-07100KL: 100 kOhms ±1% 0.1W, 1/10W Chip Resistor 0603 (1608 Metric) Moisture Resistant Thick Film; Manufacturer: Yageo; Temperature Coefficient: 100ppm/°C; Voltage Rating (DC): 50V; Power Rating: 100mW; Working Voltage: 75V; Supplier 1: Digi-Key; Manufacturer Part Number: RC0603FR-07100KL; Stock 1: 51668804; Pricing 1: 1 = 0.10000, 10 = 0.02400, 100 = 0.00970, 1000 = 0.00437, 2500 = 0.00379 (USD); RoHS: Yes; Number of Pins: 2; Case Code (Imperial): 0603; Case Code (Metric): 1608; Min Operating Temperature: -55°C; Max Operating Temperature: 155°C; Tolerance: 1%; Composition: Thick Film; Packaging: Tape and Reel; Voltage Rating: 50V; Termination: SMD/SMT; Military Standard: Not; Number of Terminations: 2; Length: 1.6mm; Height: 0.45mm; Width: 0.8mm; Depth: 0.8mm; REACH SVHC: No SVHC; Lead Free: Lead Free; ComponentLink1URL: https://datasheet.ciiva.com/11808/0900766b80f96399-11808107.pdf?src-supplier=RSComponents; ComponentLink1Description: https://datasheet.ciiva.com/11808/0900766b80f96399-11808107.pdf?src-supplier=RSComponents; ComponentLink2URL: https://datasheet.ciiva.com/7983/443971-7983593.pdf?src-supplier=Element14; ComponentLink2Description: https://datasheet.ciiva.com/7983/443971-7983593.pdf?src-supplier=Element14; ComponentLink3URL: https://datasheet.ciiva.com/46440/1868787-46440889.pdf?src-supplier=Element14; ComponentLink3Description: https://datasheet.ciiva.com/46440/1868787-46440889.pdf?src-supplier=Element14; ComponentLink4URL: https://datasheet.ciiva.com/7746/1738695-7746234.pdf?src-supplier=Element14; ComponentLink4Description: https://datasheet.ciiva.com/7746/1738695-7746234.pdf?src-supplier=Element14; ComponentLink5URL: https://datasheet.ciiva.com/7746/1738695-7746235.pdf?src-supplier=Element14; ComponentLink5Description: https://datasheet.ciiva.com/7746/1738695-7746235.pdf?src-supplier=Element14; ComponentLink6URL: https://datasheet.ciiva.com/22747/443971-22747516.pdf?src-supplier=Element14; ComponentLink6Description: https://datasheet.ciiva.com/22747/443971-22747516.pdf?src-supplier=Element14; Supplier Part Number 1: 311-100KHRCT-ND; Case/Package: 0603
R10 R38 = CRM1206-FX-10R0ELF: 10 Ohms ±1% 0.5W, 1/2W Chip Resistor 1206 (3216 Metric) Current Sense Thick Film; Manufacturer: Bourns; Power Rating: 500mW; Voltage Rating: 200V; Temperature Coefficient: 100ppm/°C; Supplier 1: Digi-Key; Manufacturer Part Number: CRM1206-FX-10R0ELF; Stock 1: 663389; Pricing 1: 1 = 0.14000, 10 = 0.12100, 25 = 0.08760, 50 = 0.06360, 100 = 0.04720, 250 = 0.03620, 500 = 0.02852, 1000 = 0.01975 (USD); RoHS: Yes; Number of Pins: 2; Case Code (Metric): 3216; Case Code (Imperial): 1206; Min Operating Temperature: -55°C; Max Operating Temperature: 155°C; Packaging: Tape and Reel; Tolerance: 1%; Package Quantity: 1; Composition: Thick Film; Number of Terminations: 2; Military Standard: Not; Max Power Dissipation: 500mW; Voltage Rating (DC): 200V; Length: 3.1mm; Height: 0.026inch; Width: 0.063inch; Depth: 1.6mm; REACH SVHC: No SVHC; ComponentLink1URL: https://datasheet.ciiva.com/7985/1859481-7985941.pdf?src-supplier=Element14; ComponentLink1Description: https://datasheet.ciiva.com/7985/1859481-7985941.pdf?src-supplier=Element14; ComponentLink2URL: https://datasheet.ciiva.com/22693/1859481-22693291.pdf?src-supplier=Element14; ComponentLink2Description: https://datasheet.ciiva.com/22693/1859481-22693291.pdf?src-supplier=Element14; ComponentLink3URL: https://datasheet.ciiva.com/6550/crm0805-1206-2010-6550028.pdf?src-supplier=Digi-Key; ComponentLink3Description: https://datasheet.ciiva.com/6550/crm0805-1206-2010-6550028.pdf?src-supplier=Digi-Key; ComponentLink4URL: https://datasheet.ciiva.com/6550/crm0805-1206-2010-6550031.pdf?src-supplier=Digi-Key; ComponentLink4Description: https://datasheet.ciiva.com/6550/crm0805-1206-2010-6550031.pdf?src-supplier=Digi-Key; ComponentLink5URL: https://datasheet.ciiva.com/48692/001055576-da-01-en-wid-crm1206-fx-10r0elf-10-ohm-1-2w-1-48692299.pdf?src-supplier=Conrad; ComponentLink5Description: https://datasheet.ciiva.com/48692/001055576-da-01-en-wid-crm1206-fx-10r0elf-10-ohm-1-2w-1-48692299.pdf?src-supplier=Conrad; Supplier Part Number 1: CRM1206-FX-10R0ELFCT-ND; Case/Package: 1206
R11 R12 = RMCF0603FT4R99: 4.99 Ohms ±1% 0.1W, 1/10W Chip Resistor 0603 (1608 Metric) Automotive AEC-Q200 Thick Film; Manufacturer: Stackpole Electronics; Max Power Dissipation: 100mW; Temperature Coefficient: 200ppm/°C; Supplier 1: Digi-Key; Manufacturer Part Number: RMCF0603FT4R99; Stock 1: 147056; Pricing 1: 1 = 0.10000, 10 = 0.02500, 100 = 0.01020, 1000 = 0.00459, 2500 = 0.00398 (USD); RoHS: Yes; Mount: Surface Mount; Case Code (Metric): 1608; Case Code (Imperial): 0603; Contact Plating: Tin; Min Operating Temperature: -55°C; Max Operating Temperature: 155°C; Packaging: Tape and Reel; Tolerance: 1%; Composition: Thick Film; Number of Terminations: 2; Features: Automotive AEC-Q200; Length: 0.061inch; Height: 0.022inch; Width: 0.031inch; Radiation Hardening: No; Lead Free: Lead Free; ComponentLink1URL: https://www.seielect.com/catalog/SEI-RMCF_RMCP.pdf?src-supplier=Avnet; ComponentLink1Description: https://www.seielect.com/catalog/SEI-RMCF_RMCP.pdf?src-supplier=Avnet; ComponentLink2URL: https://www.seielect.com/catalog/sei-rmcf_rmcp.pdf?src-supplier=Digi-Key; ComponentLink2Description: https://www.seielect.com/catalog/sei-rmcf_rmcp.pdf?src-supplier=Digi-Key; Supplier Part Number 1: RMCF0603FT4R99CT-ND; Case/Package: 0603
R13 = SMD_RES0805: GateName_1: G$1; SymbolName_1: RESISTOR; DeviceName: 0805; LibraryName: Roambotics; DeviceSetName: SMD_RES
R14 = RMCF0603JT20K0: 20 kOhms ±5% 0.1W, 1/10W Chip Resistor 0603 (1608 Metric) Automotive AEC-Q200 Thick Film; Manufacturer: Stackpole Electronics; Power Rating: 100mW; Temperature Coefficient: 100ppm/°C; Supplier 1: Digi-Key; Manufacturer Part Number: RMCF0603JT20K0; Stock 1: 63686; Pricing 1: 1 = 0.10000, 10 = 0.01500, 100 = 0.00610, 1000 = 0.00275, 2500 = 0.00239 (USD); RoHS: Yes; Mount: Surface Mount; Case Code (Metric): 1608; Case Code (Imperial): 0603; Contact Plating: Tin; Min Operating Temperature: -55°C; Max Operating Temperature: 155°C; Tolerance: 5%; Packaging: Tape and Reel; Composition: Thick Film; Number of Terminations: 2; Military Standard: Not; Max Power Dissipation: 100mW; Features: Automotive AEC-Q200; Length: 0.061inch; Height: 0.022inch; Width: 0.031inch; Depth: 0.8mm; Radiation Hardening: No; Lead Free: Lead Free; ComponentLink1URL: http://components.arrow.com/part/dataview/40962070S7654859N1174?src-supplier=Arrow; ComponentLink1Description: http://components.arrow.com/part/dataview/40962070S7654859N1174?src-supplier=Arrow; ComponentLink2URL: https://www.seielect.com/Catalog/SEI-RMCF_RMCP.pdf?src-supplier=Digi-Key; ComponentLink2Description: https://www.seielect.com/Catalog/SEI-RMCF_RMCP.pdf?src-supplier=Digi-Key; ComponentLink3URL: https://www.seielect.com/catalog/SEI-Packaging.pdf?src-supplier=Digi-Key; ComponentLink3Description: https://www.seielect.com/catalog/SEI-Packaging.pdf?src-supplier=Digi-Key; ComponentLink4URL: https://www.seielect.com/catalog/SEI-RMCF_RMCP.pdf?src-supplier=Avnet; ComponentLink4Description: https://www.seielect.com/catalog/SEI-RMCF_RMCP.pdf?src-supplier=Avnet; ComponentLink5URL: http://www.seielect.com/catalog/sei-rmc.pdf?src-supplier=Future+Electronics; ComponentLink5Description: http://www.seielect.com/catalog/sei-rmc.pdf?src-supplier=Future+Electronics; ComponentLink6URL: https://www.verical.com/server-webapp/html/getDatasheet?partID=493746&src-supplier=Verical; ComponentLink6Description: https://www.verical.com/server-webapp/html/getDatasheet?partID=493746&src-supplier=Verical; Supplier Part Number 1: RMCF0603JT20K0CT-ND; Case/Package: 0603
R15 R16 R18 R24 = CRCW060310R0FKEAC: 10 Ohms ±1% 0.1W, 1/10W Chip Resistor 0603 (1608 Metric)  Thick Film; Manufacturer: Vishay; Power Rating: 100mW; Supplier 1: Digi-Key; Manufacturer Part Number: CRCW060310R0FKEAC; Stock 1: 794480; Pricing 1: 1 = 0.10000, 10 = 0.03800, 100 = 0.01550, 1000 = 0.00694, 2500 = 0.00603 (USD); RoHS: No; Tolerance: 1%; Lead Free: Lead Free; ComponentLink1URL: http://www.vishay.com/docs/28773/crcwce3.pdf?src-supplier=Digi-Key; ComponentLink1Description: http://www.vishay.com/docs/28773/crcwce3.pdf?src-supplier=Digi-Key; Supplier Part Number 1: 541-3952-1-ND; Case/Package: 0603
R17 R33 = CRCW060310K0FKEA: 10 kOhms ±1% 0.1W, 1/10W Chip Resistor 0603 (1608 Metric) Automotive AEC-Q200 Thick Film; Manufacturer: Vishay; Manufacturer Part Number: CRCW060310K0FKEAHP; Temperature Coefficient: 100ppm/°C; Power Rating: 250mW; Voltage Rating: 75V; Supplier 1: Digi-Key; Stock 1: 0; Pricing 1: 1 = 0.18000, 10 = 0.15600, 100 = 0.06090, 1000 = 0.02548, 2500 = 0.02336 (USD); RoHS: Yes; Weight: 7.1E-05oz; Contact Plating: Tin; Case Code (Metric): 1608; Case Code (Imperial): 0603; Min Operating Temperature: -55°C; Max Operating Temperature: 155°C; Tolerance: 1%; Composition: Thick Film; Packaging: Tape and Reel; Package Quantity: 10; Number of Terminations: 2; Termination: SMD/SMT; Military Standard: Not; Voltage Rating (DC): 75V; Max Power Dissipation: 250mW; Features: Automotive AEC-Q200; Length: 1.6mm; Height: 0.45mm; Width: 0.033inch; Depth: 0.85mm; Radiation Hardening: No; Lead Free: Lead Free; REACH SVHC: Unknown; ComponentLink1URL: https://datasheet.ciiva.com/2472/crcwhpe3-2472534.pdf?src-supplier=Digi-Key; ComponentLink1Description: https://datasheet.ciiva.com/2472/crcwhpe3-2472534.pdf?src-supplier=Digi-Key; ComponentLink2URL: https://datasheet.ciiva.com/9052/crcwhpe3-9052617.pdf?src-supplier=Avnet; ComponentLink2Description: https://datasheet.ciiva.com/9052/crcwhpe3-9052617.pdf?src-supplier=Avnet; ComponentLink3URL: https://datasheet.ciiva.com/3256/crcwhpe3-3256941.pdf?src-supplier=Avnet; ComponentLink3Description: https://datasheet.ciiva.com/3256/crcwhpe3-3256941.pdf?src-supplier=Avnet; ComponentLink4URL: https://datasheet.ciiva.com/28588/1912814-28588878.pdf?src-supplier=Element14; ComponentLink4Description: https://datasheet.ciiva.com/28588/1912814-28588878.pdf?src-supplier=Element14; ComponentLink5URL: https://datasheet.ciiva.com/5548/crcwhpe3-46056-5548143.pdf?src-supplier=Mouser; ComponentLink5Description: https://datasheet.ciiva.com/5548/crcwhpe3-46056-5548143.pdf?src-supplier=Mouser; ComponentLink6URL: https://datasheet.ciiva.com/2472/crcwhpe3-2472532.pdf?src-supplier=Digi-Key; ComponentLink6Description: https://datasheet.ciiva.com/2472/crcwhpe3-2472532.pdf?src-supplier=Digi-Key; ComponentLink7URL: https://datasheet.ciiva.com/2472/crcwhpe3-2472533.pdf?src-supplier=Digi-Key; ComponentLink7Description: https://datasheet.ciiva.com/2472/crcwhpe3-2472533.pdf?src-supplier=Digi-Key; Supplier Part Number 1: 541-10.0KSCT-ND
R19 = RC0603FR-07383KL: 383 kOhms ±1% 0.1W, 1/10W Chip Resistor 0603 (1608 Metric) Moisture Resistant Thick Film; Manufacturer: Yageo; Voltage Rating: 75V; Power Rating: 100mW; Temperature Coefficient: 100ppm/°C; Voltage Rating (DC): 50V; Supplier 1: Digi-Key; Manufacturer Part Number: RC0603FR-07383KL; Stock 1: 541343; Pricing 1: 1 = 0.10000, 10 = 0.02400, 100 = 0.00970, 1000 = 0.00437, 2500 = 0.00379 (USD); RoHS: Yes; Weight: 7.1E-05oz; Case Code (Imperial): 0603; Case Code (Metric): 1608; Min Operating Temperature: -55°C; Max Operating Temperature: 155°C; Tolerance: 1%; Packaging: Tape and Reel; Package Quantity: 1; Termination: SMD/SMT; Composition: Thick Film; Number of Terminations: 2; Military Standard: Not; Max Power Dissipation: 100mW; Features: Moisture Resistant; Length: 1.6mm; Height: 0.022inch; Width: 0.8mm; Depth: 0.8mm; Lead Free: Lead Free; ComponentLink1URL: https://datasheet.ciiva.com/2454/pyu-r-int-thick-7-2454780.pdf?src-supplier=Digi-Key; ComponentLink1Description: https://datasheet.ciiva.com/2454/pyu-r-int-thick-7-2454780.pdf?src-supplier=Digi-Key; ComponentLink2URL: https://datasheet.ciiva.com/2454/pyu-r-int-thick-7-2454781.pdf?src-supplier=Digi-Key; ComponentLink2Description: https://datasheet.ciiva.com/2454/pyu-r-int-thick-7-2454781.pdf?src-supplier=Digi-Key; ComponentLink3URL: https://datasheet.ciiva.com/2454/pyu-r-int-thick-7-2454782.pdf?src-supplier=Digi-Key; ComponentLink3Description: https://datasheet.ciiva.com/2454/pyu-r-int-thick-7-2454782.pdf?src-supplier=Digi-Key; Supplier Part Number 1: 311-383KHRCT-ND; Case/Package: 0603
R27 = RC0603FR-07127KL: 127 kOhms ±1% 0.1W, 1/10W Chip Resistor 0603 (1608 Metric) Moisture Resistant Thick Film; Manufacturer: Yageo; Power Rating: 100mW; Voltage Rating: 50V; Temperature Coefficient: 100ppm/°C; Working Voltage: 75V; Supplier 1: Digi-Key; Manufacturer Part Number: RC0603FR-07127KL; Stock 1: 339894; Pricing 1: 1 = 0.10000, 10 = 0.02400, 100 = 0.00970, 1000 = 0.00437, 2500 = 0.00379 (USD); RoHS: Yes; Case Code (Metric): 1608; Case Code (Imperial): 0603; Min Operating Temperature: -55°C; Max Operating Temperature: 155°C; Tolerance: 1%; Packaging: Tape and Reel; Package Quantity: 1; Composition: Thick Film; Number of Terminations: 2; Termination: SMD/SMT; Military Standard: Not; Max Power Dissipation: 100mW; Voltage Rating (DC): 50V; Features: Moisture Resistant; Length: 1.6mm; Height: 0.022inch; Width: 0.031inch; Depth: 0.8mm; Lead Free: Lead Free; ComponentLink1URL: https://datasheet.ciiva.com/2454/pyu-r-int-thick-7-2454642.pdf?src-supplier=Digi-Key; ComponentLink1Description: https://datasheet.ciiva.com/2454/pyu-r-int-thick-7-2454642.pdf?src-supplier=Digi-Key; ComponentLink2URL: https://datasheet.ciiva.com/2454/pyu-r-int-thick-7-2454643.pdf?src-supplier=Digi-Key; ComponentLink2Description: https://datasheet.ciiva.com/2454/pyu-r-int-thick-7-2454643.pdf?src-supplier=Digi-Key; ComponentLink3URL: https://datasheet.ciiva.com/2454/pyu-r-int-thick-7-2454644.pdf?src-supplier=Digi-Key; ComponentLink3Description: https://datasheet.ciiva.com/2454/pyu-r-int-thick-7-2454644.pdf?src-supplier=Digi-Key; Supplier Part Number 1: 311-127KHRCT-ND; Case/Package: 0603
R28 R29 = RC0603FR-0760R4L: RES SMD 60.4 OHM 1% 1/10W 0603; Manufacturer: Yageo; Temperature Coefficient: ±100ppm/°C; Power (Watts): 0.1W, 1/10W; Supplier 1: Digi-Key; RoHS: RoHS Compliant; Category: Resistors; Stock 1: 67421; Pricing 1: 1=0.1, 10=0.013, 25=0.0092, 50=0.007, 100=0.0052, 250=0.00396, 500=0.00316, 1000=0.00233 (USD); Packaging: Digi-Reel®; Composition: Thick Film; Features: Moisture Resistant; Operating Temperature: -55°C ~ 155°C; Package / Case: 0603; Supplier Device Package: 0603; Size / Dimension: 0.063" L x 0.031" W (1.60mm x 0.80mm); ComponentLink1URL: http://www.yageo.com/documents/recent/PYu-RC_Group_51_RoHS_L_6.pdf; ComponentLink1Description: http://www.yageo.com/documents/recent/PYu-RC_Group_51_RoHS_L_6.pdf; Supplier Part Number 1: 311-60.4HRDKR-ND; Tolerance: ±1%; Manufacturer Part Number: RC0603FR-0760R4L; Part Status: Active; Height - Seated (Max): 0.022" (0.55mm); Failure Rate: -
U1 = ATTINY816-MFR: Mcu, 8bit, Pic24fj, 20mhz, Qfn-20; GateName_1: G$1; MF: Microchip; SymbolName_1: ATTINY816-MFR; LibraryName: ATTINY816-MFR; DeviceSetName: ATTINY816-MFR; DIGI-KEY_PART_NUMBER: ATTINY816-MFRCT-ND; DIGI-KEY_PURCHASE_URL: https://www.digikey.com/product-detail/en/microchip-technology/ATTINY816-MFR/ATTINY816-MFRCT-ND/6556166?utm_source=snapeda&utm_medium=aggregator&utm_campaign=symbol; MP: ATTINY816-MFR; PACKAGE: QFN-20 Microchip
U2 = LM3480IM3-3.3TR-ND: GateName_1: G$1; SymbolName_1: LM3480IM3-3.3TR-ND; LibraryName: Roambotics; DeviceSetName: LM3480IM3-3.3TR-ND; LM3480IM3-3.3TR-ND: LM3480IM3-3.3TR-ND
U$1 = ATTINY_DEBUG: GateName_1: G$1; SymbolName_1: ATTINY_DEBUG; LibraryName: Roambotics; DeviceSetName: ATTINY_DEBUG